# EAGLE schematic PGA44DIP44 (EAGLE 8.1.1)
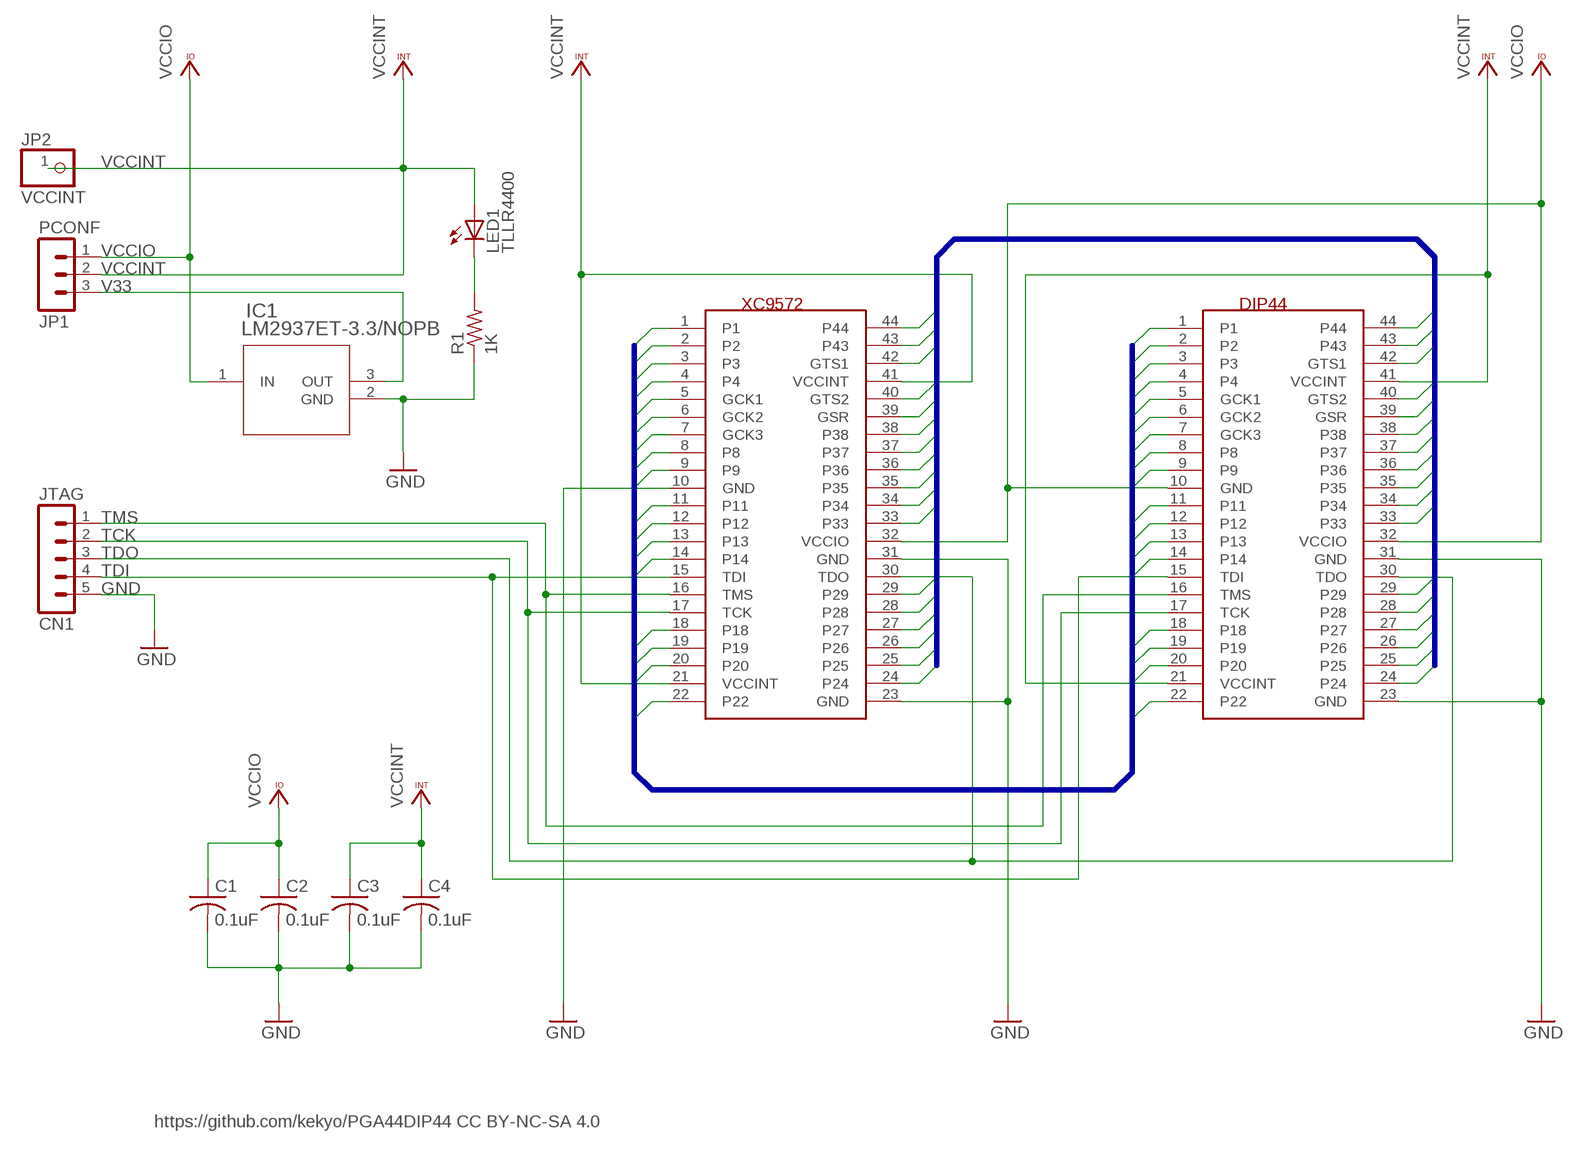
[diagram p0: schematic, sheet 1]

## Parts
C1  0.1uF  C-US050-024X044  [C050-024X044]
C2  0.1uF  C-US050-024X044  [C050-024X044]
C3  0.1uF  C-US050-024X044  [C050-024X044]
C4  0.1uF  C-US050-024X044  [C050-024X044]
CN1  JTAG  MA05-1  [MA05-1]
DIP44  DIP44  [DIP44]
IC1  LM2937ET-3.3/NOPB  [T03B]
JP1  PCONF  MA03-1  [MA03-1]
JP2  VCCINT  PINHD-1X1  [1X01]
LED1  TLLR4400  [LED3MM]
R1  1K  R-US_0207/2V  [0207/2V]
XC9572  PGA44  [PGA44]

## Nets
GND: C1.2 C2.2 C3.2 C4.2 CN1.5 DIP44.23(GND) DIP44.31(GND) IC1.2(GND) R1.1 XC9572.10(GND) XC9572.23(GND) XC9572.31(GND)
L1: DIP44.1 XC9572.1
L2: DIP44.2 XC9572.2
L3: DIP44.3 XC9572.3
L4: DIP44.4 XC9572.4
L5: DIP44.5(GCK1) XC9572.5(GCK1)
L6: DIP44.6(GCK2) XC9572.6(GCK2)
L7: DIP44.7(GCK3) XC9572.7(GCK3)
L8: DIP44.8 XC9572.8
L9: DIP44.9 XC9572.9
L11: DIP44.11 XC9572.11
L12: DIP44.12 XC9572.12
L13: DIP44.13 XC9572.13
L14: DIP44.14 XC9572.14
L18: DIP44.18 XC9572.18
L19: DIP44.19 XC9572.19
L20: DIP44.20 XC9572.20
L22: DIP44.22 XC9572.22
L24: DIP44.24 XC9572.24
L25: DIP44.25 XC9572.25
L26: DIP44.26 XC9572.26
L27: DIP44.27 XC9572.27
L28: DIP44.28 XC9572.28
L29: DIP44.29 XC9572.29
L33: DIP44.33 XC9572.33
L34: DIP44.34 XC9572.34
L35: DIP44.35 XC9572.35
L36: DIP44.36 XC9572.36
L37: DIP44.37 XC9572.37
L38: DIP44.38 XC9572.38
L39: DIP44.39(GSR) XC9572.39(GSR)
L40: DIP44.40(GTS2) XC9572.40(GTS2)
L42: DIP44.42(GTS1) XC9572.42(GTS1)
L43: DIP44.43 XC9572.43
L44: DIP44.44 XC9572.44
N$1: LED1.K(C) R1.2
TCK: CN1.2 DIP44.17(TCK) XC9572.17(TCK)
TDI: CN1.4 DIP44.15(TDI) XC9572.15(TDI)
TDO: CN1.3 DIP44.30(TDO) XC9572.30(TDO)
TMS: CN1.1 DIP44.16(TMS) XC9572.16(TMS)
V33: IC1.3(OUT) JP1.3
VCCINT: C3.1 C4.1 DIP44.21(VCCINT) DIP44.41(VCCINT) JP1.2 JP2.1 LED1.A XC9572.21(VCCINT) XC9572.41(VCCINT)
VCCIO: C1.1 C2.1 DIP44.10(GND) DIP44.32(VCCIO) IC1.1(IN) JP1.1 XC9572.32(VCCIO)

## Buses
L[1..22]
L[23..44]

## Notes on the sheet
- https://github.com/kekyo/PGA44DIP44 CC BY-NC-SA 4.0

## Library data of the parts
C1-C4 = rcl:C-US: CAPACITOR, American symbol
CN1 = PGA44DIP44:MA05-1: PIN HEADER; OC_FARNELL: unknown; OC_NEWARK: unknown
DIP44 = PGA44DIP44:DIP44
IC1 = PGA44DIP44:LM2937ET-3.3/NOPB; MANUFACTURER_PART_NUMBER: lm2937et3_3nopb; VENDOR: National Semiconductor
JP1 = PGA44DIP44:MA03-1: PIN HEADER; OC_FARNELL: unknown; OC_NEWARK: unknown
JP2 = PGA44DIP44:PINHD-1X1: PIN HEADER
LED1 = PGA44DIP44:TLLR4400: Low Current (2mA) LED 3 mm Tinted Diffused Package color RED Source: Data sheet <http://www.farnell.com/datasheets/391100.pdf>; MF: VISHAY SEMICONDUCTOR; OC_FARNELL: 1612437
R1 = PGA44DIP44:R-US_: RESISTOR, American symbol
XC9572 = PGA44DIP44:PGA44